# EAGLE design high current motor controller (EAGLE 7.6.0)
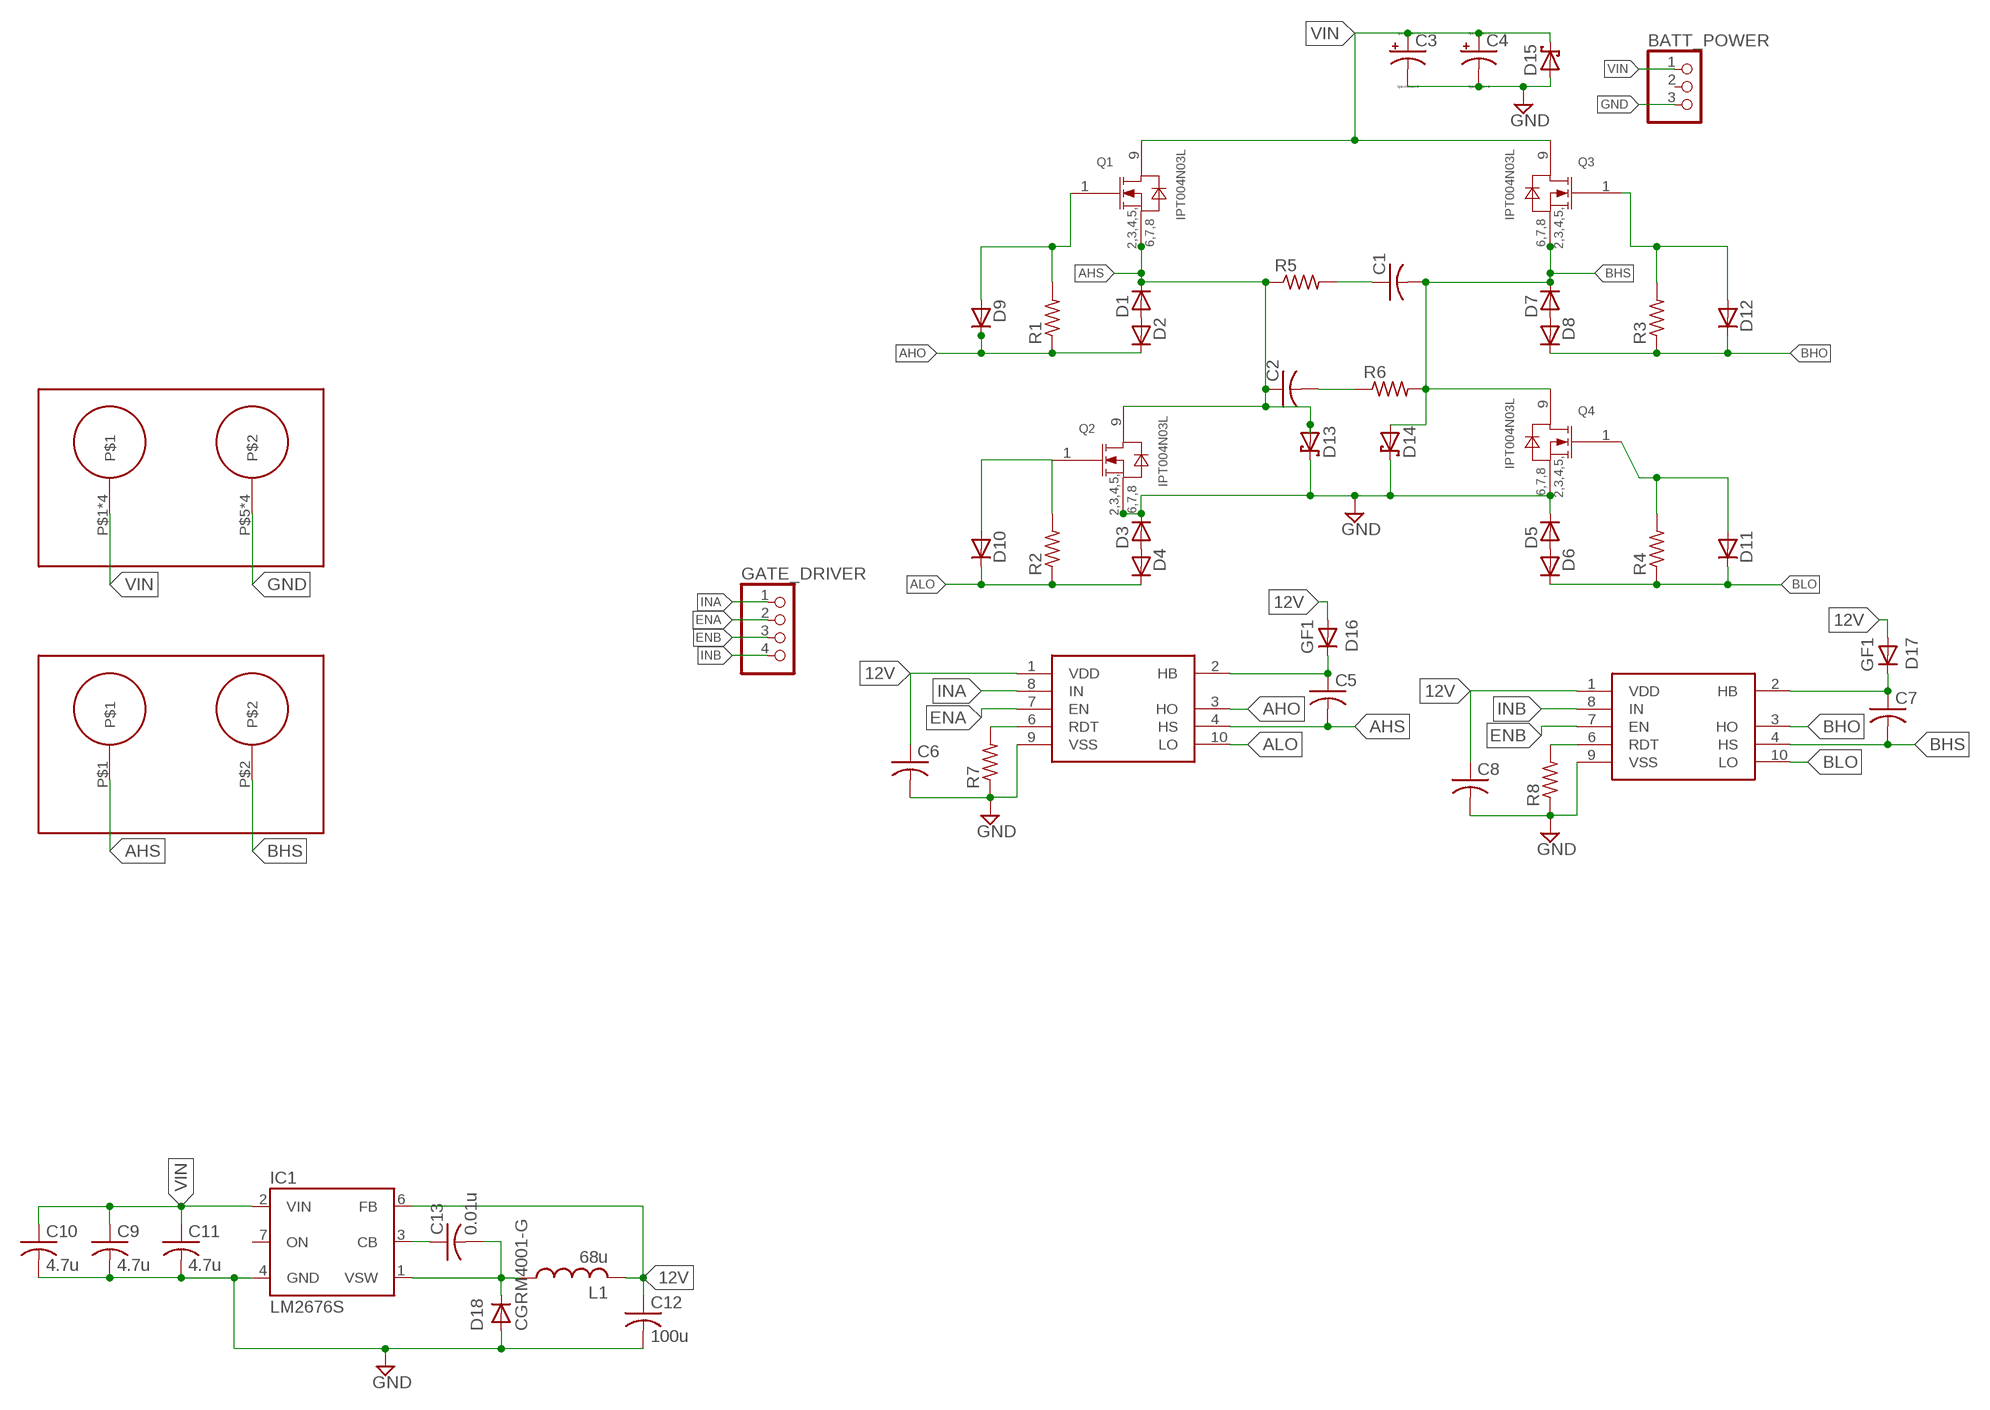
[diagram p0: schematic, sheet 1]

## Parts
BATT_POWER  PINHD-1X3  [1X03]
C1  C-USC0805  [C0805]
C2  C-USC0805  [C0805]
C3  CPOL-USE5-13  [E5-13]
C4  CPOL-USE5-13  [E5-13]
C5  C-USC0805  [C0805]
C6  C-USC0805  [C0805]
C7  C-USC0805  [C0805]
C8  C-USC0805  [C0805]
C9  4.7u  C-USC0805  [C0805]
C10  4.7u  C-USC0805  [C0805]
C11  4.7u  C-USC0805  [C0805]
C12  100u  C-USC0805  [C0805]
C13  0.01u  C-USC0805  [C0805]
D1  D-SOD123  [SOD123]
D2  D-SOD123  [SOD123]
D3  D-SOD123  [SOD123]
D4  D-SOD123  [SOD123]
D5  D-SOD123  [SOD123]
D6  D-SOD123  [SOD123]
D7  D-SOD123  [SOD123]
D8  D-SOD123  [SOD123]
D9  D-SOD123  [SOD123]
D10  D-SOD123  [SOD123]
D11  D-SOD123  [SOD123]
D12  D-SOD123  [SOD123]
D13  SCHOTTKY-DIODESMC  [SMC]
D14  SCHOTTKY-DIODESMC  [SMC]
D15  SCHOTTKY-DIODESMC  [SMC]
D16  GF1  [SMA-DO214AC]
D17  GF1  [SMA-DO214AC]
D18  CGRM4001-G  GF1  [SMA-DO214AC]
GATE_DRIVER  PINHD-1X4  [1X04]
IC1  LM2676S  [TO263-7]
L1  68u  L-USWURTH12.8X12.8  [L_WURTH_7447709680]
Q1  IPT004N03L  [INF-PG-HSOF-8-1-0]
Q2  IPT004N03L  [INF-PG-HSOF-8-1-0]
Q3  IPT004N03L  [INF-PG-HSOF-8-1-0]
Q4  IPT004N03L  [INF-PG-HSOF-8-1-0]
R1  R-US_M0805  [M0805]
R2  R-US_M0805  [M0805]
R3  R-US_M0805  [M0805]
R4  R-US_M0805  [M0805]
R5  R-US_M0805  [M0805]
R6  R-US_M0805  [M0805]
R7  R-US_M0805  [M0805]
R8  R-US_M0805  [M0805]
U$1  LM5106MM  [MSOP10]
U$2  LM5106MM  [MSOP10]
U$3  TE_2PIN_125A  [TE_125A]
U$4  MOLEX_2PIN_50A  [MOLEX_50A]

## Nets
12V: C6.1 C8.1 C12.1 D16.A D17.A IC1.6(FB) L1.P$2 U$1.1(VDD) U$2.1(VDD)
AHO: D2.1(C) D9.1(C) R1.1 U$1.3(HO)
AHS: C2.1 C5.2 D1.1(C) D13.A Q1.2 Q1.3 Q1.4 Q1.5 Q1.6 Q1.7 Q1.8 Q2.9 R5.1 U$1.4(HS) U$4.P$1
ALO: D4.1(C) D10.1(C) R2.1 U$1.10(LO)
BHO: D8.1(C) D12.1(C) R3.1 U$2.3(HO)
BHS: C1.2 C7.2 D7.1(C) D14.A Q3.2 Q3.3 Q3.4 Q3.5 Q3.6 Q3.7 Q3.8 Q4.9 R6.2 U$2.4(HS) U$4.P$2
BLO: D6.1(C) D11.1(C) R4.1 U$2.10(LO)
ENA: GATE_DRIVER.2 U$1.7(EN)
ENB: GATE_DRIVER.3 U$2.7(EN)
GND: BATT_POWER.3 C3.- C4.- C6.2 C8.2 C9.2 C10.2 C11.2 C12.2 D3.1(C) D5.1(C) D13.C D14.C D15.A D18.A IC1.4(GND) Q2.2 Q2.3 Q2.4 Q2.5 Q2.6 Q2.7 Q2.8 Q4.2 Q4.3 Q4.4 Q4.5 Q4.6 Q4.7 Q4.8 R7.1 R8.1 U$1.9(VSS) U$2.9(VSS) U$3.P$5 U$3.P$6 U$3.P$7 U$3.P$8
INA: GATE_DRIVER.1 U$1.8(IN)
INB: GATE_DRIVER.4 U$2.8(IN)
N$1: D1.2(A) D2.2(A)
N$2: R8.2 U$2.6(RDT)
N$3: R7.2 U$1.6(RDT)
N$4: C1.1 R5.2
N$5: C7.1 D17.K(C) U$2.2(HB)
N$6: D7.2(A) D8.2(A)
N$8: C5.1 D16.K(C) U$1.2(HB)
N$9: D10.2(A) Q2.1 R2.2
N$10: C2.2 R6.1
N$11: D3.2(A) D4.2(A)
N$12: D5.2(A) D6.2(A)
N$13: D9.2(A) Q1.1 R1.2
N$15: D12.2(A) Q3.1 R3.2
N$16: C13.1 IC1.3(CB)
N$17: C13.2 D18.K(C) IC1.1(VSW) L1.P$1
N$19: D11.2(A) Q4.1 R4.2
VIN: BATT_POWER.1 C3.+ C4.+ C9.1 C10.1 C11.1 D15.C IC1.2(VIN) Q1.9 Q3.9 U$3.P$1 U$3.P$1.1 U$3.P$1.2 U$3.P$1.3
Unconnected: BATT_POWER.2 IC1.7(ON)

## Library data of the parts
BATT_POWER = pinhead:PINHD-1X3: PIN HEADER
C1 C2 C5-C13 = resistor:C-US: CAPACITOR, American symbol
C3 C4 = resistor:CPOL-US: POLARIZED CAPACITOR, American symbol
D1-D12 = semicon-smd-ipc:D-: DIODE unfilled
D13-D15 = diode:SCHOTTKY-DIODE: Schottky Diode
D16-D18 = diode:GF1: DIODE
GATE_DRIVER = pinhead:PINHD-1X4: PIN HEADER
IC1 = v-reg-3:LM2676: National Semiconductor <http://www.national.com> 3.0A "Simple Switcher"(c) 260kHz, Vout 1.2-37V, Vin 40V, 150mOhm DMOS switch, 50µA standby current
L1 = resistor:L-US: INDUCTOR, American symbol
Q1-Q4 = IPT004N03L:IPT004N03L: IPT004N03L OptiMOS N-Channel Power-Transistor INF-PG-HSOF-8-1-0
R1-R8 = resistor:R-US_: RESISTOR, American symbol
U$1 U$2 = texas-instruments:LM5106
U$3 = connector:TE_2PIN_125A
U$4 = connector:MOLEX_2PIN_50A

## Board
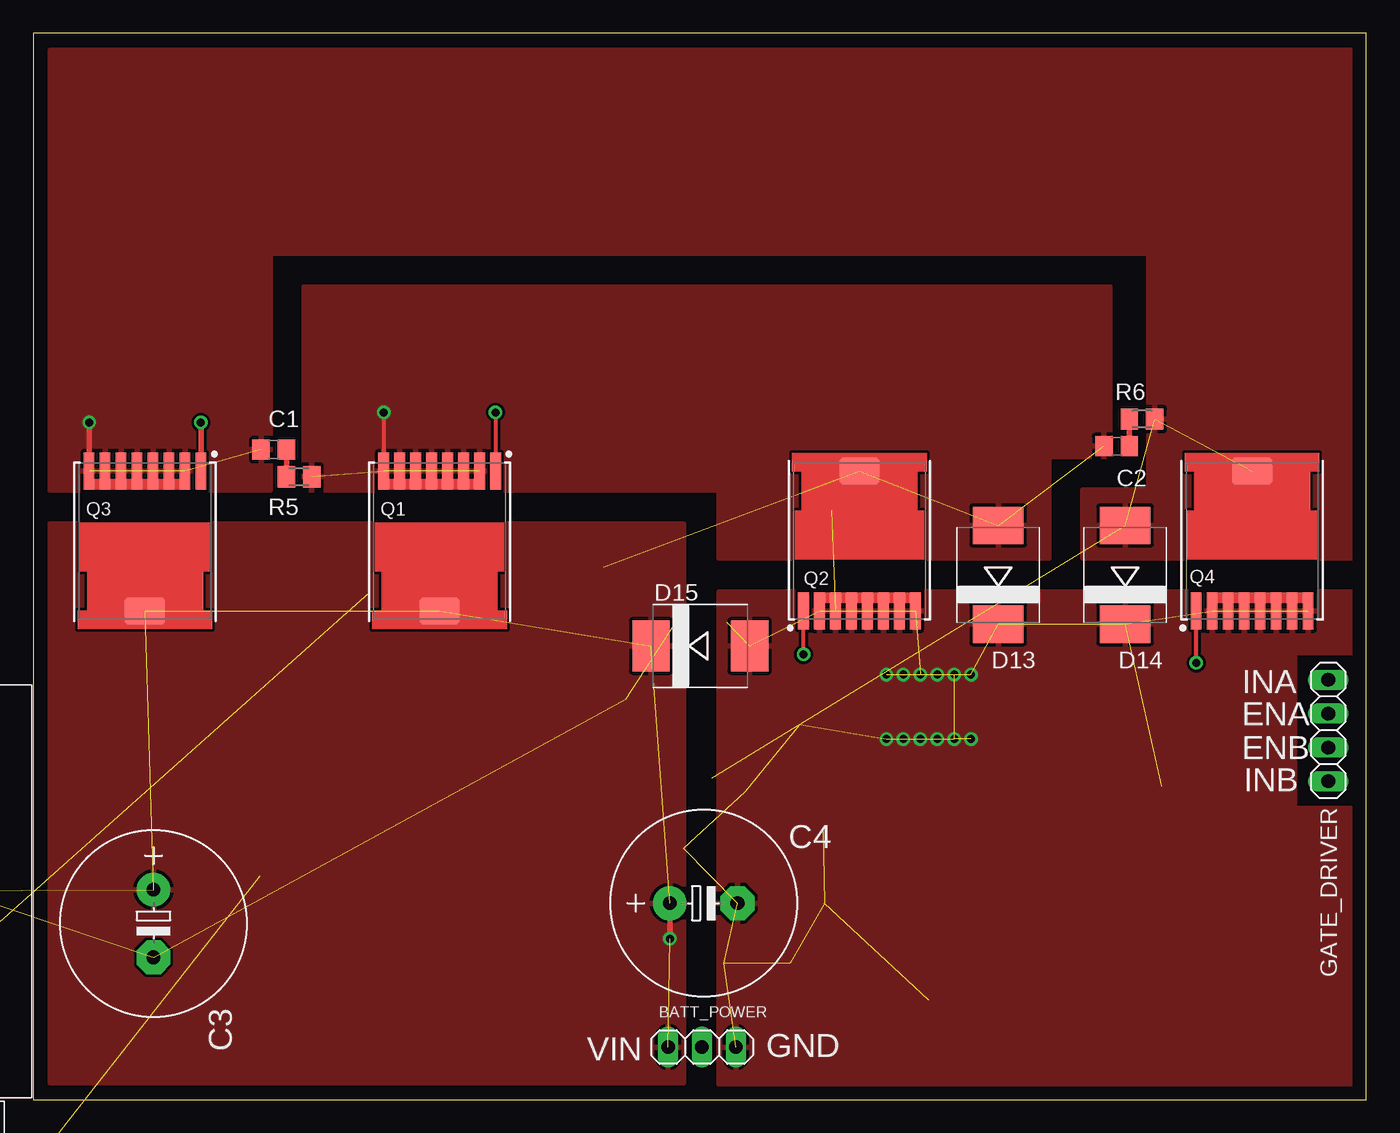
[diagram p1: board, top side]
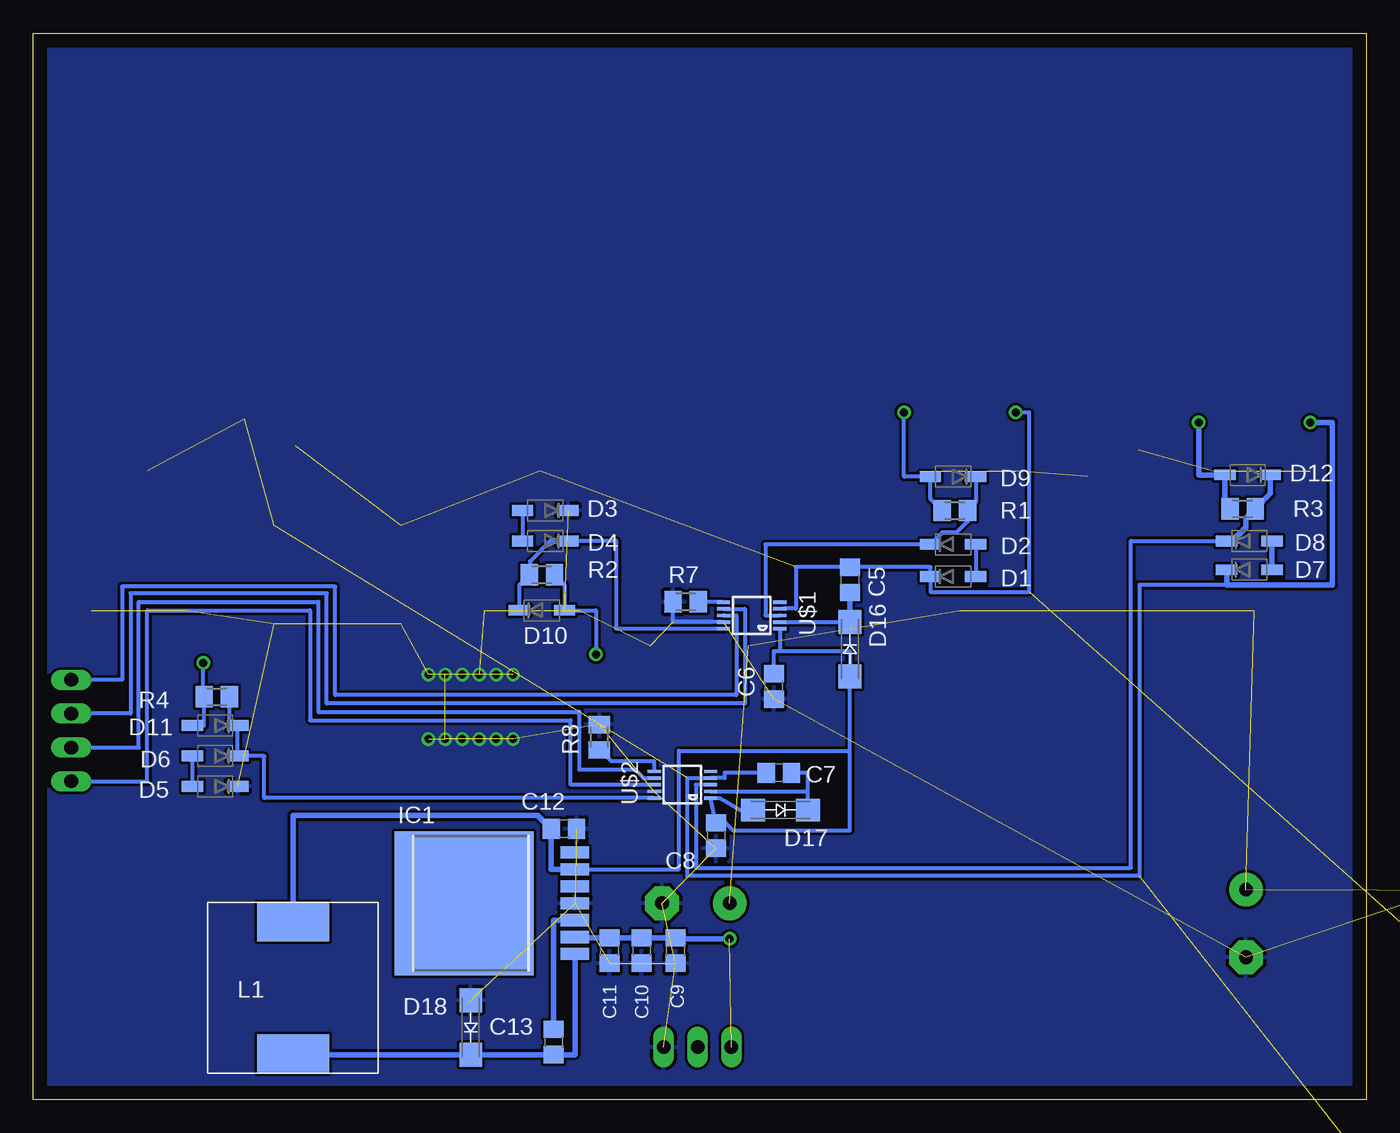
[diagram p2: board, bottom side, seen from below]

Size 100 x 80 mm. Coordinates in mm from the lower left corner, seen from the top.
Outline: 0,0 100,0 100,80 0,80 0,0
Copper layers (1*16): Top 0.035mm / dielectric 1.5mm / Bottom 0.035mm
Design rules "default": minimum track width 10mil, minimum drill 24mil, track to track 8mil, track to pad 8mil, pad to pad 8mil, via to via 8mil, smd to smd 8mil, copper to edge 40mil, drill to drill 8mil, minimum pad ring 10mil, minimum via ring 8mil, stop-mask expansion 4mil, vias tented up to drill 0mil, thermal gap 10mil

### Footprints (pad centres in the part's own frame; a part is rotated, then mirrored left to right if it is on the bottom)
1X03 = drill 1.016 long: 1 -2.54,0; 2 0,0; 3 2.54,0
C0805 = smd 1.3 x 1.5: 1 -0.95,0; 2 0.95,0
E5-13 = drill 1.016 pad 2.54: + -2.54,0 | drill 1.016 pad 2.54 octagon: - 2.54,0
SOD123 = smd 1.6 x 0.8: 1 -1.7,0; 2 1.7,0
SMC = smd 2.8 x 3.8: A 3.7,0; C -3.7,0
SMA-DO214AC = smd 1.8 x 1.7: A -2.05,0; K 2.05,0
1X04 = drill 1.016 long: 1 -3.81,0; 2 -1.27,0; 3 1.27,0; 4 3.81,0
TO263-7 = smd 0.91 x 2.16: 1 -3.81,-5.78; 2 -2.54,-5.78; 3 -1.27,-5.78; 4 0,-5.78; 5 1.27,-5.78; 6 2.54,-5.78; 7 3.81,-5.78 | smd 10.8 x 10.41: 8 0,2.54
L_WURTH_7447709680 = smd 5.4 x 2.9: P$1 0,4.95; P$2 0,-4.95
INF-PG-HSOF-8-1-0 = smd 2.8 x 0.8: 1 -5.25,4.2; 2 -5.25,3; 3 -5.25,1.8; 4 -5.25,0.6; 5 -5.25,-0.6; 6 -5.25,-1.8; 7 -5.25,-3; 8 -5.25,-4.2 | smd 2 x 3: 9 5.25,0
M0805 = smd 1.3 x 1.6: 1 -0.95,0; 2 0.95,0
MSOP10 = smd 0.25 x 1: 1 -1,-2.113; 2 -0.5,-2.113; 3 0,-2.113; 4 0.5,-2.113; 5 1,-2.113; 6 1,2.113; 7 0.5,2.113; 8 0,2.113; 9 -0.5,2.113; 10 -1,2.113
TE_125A = drill 2: P$1 -9.4,12.5; P$1.1 -5.6,12.5; P$1.2 -9.4,0; P$1.3 -5.6,0; P$5 5.6,12.5; P$6 9.4,12.5; P$7 5.6,0; P$8 9.4,0
MOLEX_50A = drill 4: P$1 -6.35,6.5; P$2 6.35,-6.5

### Placement (x,y rotation side)
BATT_POWER  50.16,3.94 0 top
C1  18.03,48.77 180 top
C2  81.28,49.02 0 top
C3  9.02,13.21 270 top
C4  50.29,14.73 0 top
C5  38.73,38.99 90 bottom
C6  44.45,30.99 270 bottom
C7  44.07,24.51 180 bottom
C8  48.77,19.81 270 bottom
C9  51.82,11.18 270 bottom
C10  54.36,11.18 270 bottom
C11  56.77,11.18 270 bottom
C12  60.2,20.32 0 bottom
C13  60.96,4.32 270 bottom
D1  30.99,39.24 0 bottom
D2  30.99,41.66 0 bottom
D3  61.59,44.2 180 bottom
D4  61.59,41.91 180 bottom
D5  86.36,23.5 180 bottom
D6  86.36,25.78 180 bottom
D7  8.76,39.75 0 bottom
D8  8.76,41.91 0 bottom
D9  30.99,46.74 180 bottom
D10  61.85,36.7 0 bottom
D11  86.36,28.07 180 bottom
D12  8.89,46.86 180 bottom
D13  72.39,39.37 90 top
D14  81.92,39.37 90 top
D15  50.04,34.04 0 top
D16  38.73,33.78 90 bottom
D17  43.94,21.72 0 bottom
D18  67.18,5.41 270 bottom
GATE_DRIVER  97.16,27.69 270 top
IC1  65.15,14.73 90 bottom
L1  80.52,8.38 180 bottom
Q1  30.48,41.91 270 top
Q2  61.98,41.91 90 top
Q3  8.38,41.91 270 top
Q4  91.44,41.91 90 top
R1  30.86,44.2 180 bottom
R2  61.85,39.37 0 bottom
R3  9.27,44.32 180 bottom
R4  86.23,30.23 180 bottom
R5  19.94,46.74 180 top
R6  83.19,51.05 0 top
R7  51.05,37.34 0 bottom
R8  57.53,27.18 270 bottom
U$1  46.1,36.32 90 bottom
U$2  51.31,23.62 90 bottom
U$3  -15.11,15.62 0 top  (outside the outline)
U$4  -16.13,-10.92 0 top  (outside the outline)

### Tracks (layer width: path | path; a pad name or v marks a point on that pad's centre or on a via)
12V
  Bottom 0.305: D17.A 46.99,21.72 48.53,22.62 U$2.1 C8.1 48.07,20.76 47.5,20.19 38.73,20.19 38.73,26.16 | U$1.1 43.99,33.66 | 43.99,33.66 38.73,33.66 D16.A 38.73,26.16 | C6.1 44.45,33.66 43.99,33.66 | IC1.6 51.56,17.27 51.56,26.16 38.73,26.16
  Bottom 0.406: L1.P$2 80.52,21.34 62.16,21.34 C12.1 61.15,17.27 IC1.6
AHO
  Bottom 0.305: D9.1 29.29,44.82 R1.1 29.91,43.37 30.73,42.55 31.8,42.55 D2.1 45.09,41.66 45.09,36.32 U$1.3
AHS  (via drill 0.6)  (11 unrouted)
  Top 0.305: v26.29,51.56 Q1.8
  Bottom 0.305: U$1.4 43.73,36.83 42.8,36.83 42.8,39.94 C5.2 32.69,39.94 D1.1 32.69,38.1 25.27,38.1 25.27,51.56 v26.29,51.56
  pour Top: 20.32,60.96 80.77,60.96 80.77,48.26 76.2,48.26 76.2,40.64 51.44,40.64 51.44,45.72 20.32,45.72
ALO
  Bottom 0.305: D10.1 63.55,38.62 R2.1 62.74,39.43 62.74,40.39 61.21,41.91 D4.1 56.26,41.91 56.26,35.32 U$1.10
BHO
  Bottom 0.305: U$2.3 50.29,23.62 50.29,17.4 17.65,17.4 17.65,41.91 D8.1
  Bottom 0.406: D8.1 10.03,41.91 9.02,42.93 9.02,43.63 R3.1 7.19,45.45 D12.1
BHS  (via drill 0.6)  (11 unrouted)
  Top 0.406: v4.19,50.8 Q3.8
  Bottom 0.305: C7.2 48.13,24.51 48.13,24.13 U$2.4 | 10.46,38.61 17.02,38.61 17.02,16.76 50.93,16.76 50.93,24.13 U$2.4 | U$2.4
  Bottom 0.406: D7.1 10.46,38.61 2.54,38.61 2.54,50.8 v4.19,50.8
  pour Top: 1.27,78.74 99.06,78.74 99.06,40.64 78.74,40.64 78.74,45.72 83.69,45.72 83.69,63.5 17.78,63.5 17.78,45.72 1.27,45.72
BLO
  Bottom 0.305: R4.1 85.28,28.07 D11.1 D6.1 82.68,25.78 82.68,22.62 U$2.10
ENA
  Bottom 0.305: U$1.7 46.61,36.82 46.61,29.72 77.98,29.72 77.98,37.97 92.71,37.97 92.71,28.96 GATE_DRIVER.2
ENB
  Bottom 0.305: GATE_DRIVER.3 92.08,26.42 92.08,37.34 78.61,37.34 78.61,29.08 59.05,29.08 59.05,24.77 54.86,24.77 54.23,24.13 U$2.7
GND  (via drill 0.6)  (48 unrouted)
  Bottom 0.305: U$1.9 52,35.82 R7.1
  other vias: 64.01,27.05 65.28,27.05 66.55,27.05 67.82,27.05 69.09,27.05 70.36,27.05 70.36,31.88 69.09,31.88 67.82,31.88 66.55,31.88 65.28,31.88 64.01,31.88
  pour Top: 51.44,38.1 98.93,38.1 98.93,33.53 94.61,33.53 94.61,21.84 98.81,21.84 98.81,1.14 51.44,1.14
  pour Bottom: 1.14,79.12 99.06,79.12 99.06,0.38 1.14,0.38
INA
  Bottom 0.305: U$1.8 47.24,36.32 47.24,30.35 77.34,30.35 77.34,38.48 93.34,38.48 93.34,31.5 GATE_DRIVER.1
INB
  Bottom 0.305: U$2.8 59.69,23.62 59.69,28.45 79.25,28.45 79.25,36.7 91.44,36.7 91.44,23.88 GATE_DRIVER.4
N$1
  Bottom 0.305: D2.2 D1.2
N$2
  Bottom 0.305: R8.2 57.47,26.23 56.64,25.4 53.42,25.4 U$2.6
N$3
  Bottom 0.305: U$1.6 50.1,37.32 R7.2
N$4
  Top 0.406: C1.1 18.99,47.75 R5.2
N$5
  Bottom 0.305: D17.K 41.89,23.12 | 41.89,23.12 41.89,24.51 C7.1 | U$2.2 41.89,23.12
N$6
  Bottom 0.406: D8.2 D7.2
N$8
  Bottom 0.305: U$1.2 D16.K
  Bottom 0.406: D16.K C5.1
N$9  (via drill 0.6)
  Top 0.305: v57.78,33.4 Q2.1
  Bottom 0.305: R2.2 60.15,38.62 D10.2 57.78,36.7 v57.78,33.4
N$10
  Top 0.406: R6.1 82.23,50.04 C2.2
N$11
  Bottom 0.305: D3.2 D4.2
N$12
  Bottom 0.305: D5.2 D6.2
N$13  (via drill 0.6)
  Top 0.305: v34.67,51.56 v34.68,51.56 Q1.1
  Bottom 0.305: v34.67,51.56 34.67,46.74 D9.2 32.69,45.07 R1.2
N$15  (via drill 0.6)
  Top 0.406: v12.57,50.8 12.58,50.8 Q3.1
  Bottom 0.406: R3.2 10.59,44.69 D12.2 12.57,46.86 v12.57,50.8
N$16
  Bottom 0.406: IC1.3 60.96,13.46 C13.1
N$17
  Bottom 0.406: IC1.1 59.37,3.37 C13.2 D18.K 80.52,3.36 L1.P$1
N$19  (via drill 0.6)
  Top 0.305: v87.25,32.77 v87.24,32.77 Q4.1
  Bottom 0.305: D11.2 87.18,28.07 R4.2 87.25,30.23 v87.25,32.77
VIN  (via drill 0.6)  (9 unrouted)
  Top 0.406: v47.75,12.06 C4.+
  Bottom 0.406: IC1.2 59.37,12.13 C11.1 C10.1 C9.1 51.82,12.06 v47.75,12.06
  pour Top: 1.27,43.18 48.77,43.18 48.77,1.27 1.27,1.27

### Text on the board
_tsilk: INA | ENA | ENB | INB | VIN | GND